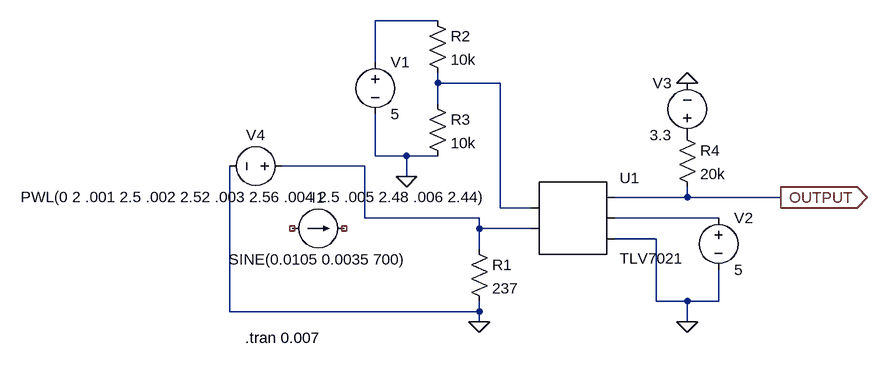
[diagram p0: schematic WheelSpeed_rev11_v2.asc]
WheelSpeed_rev11_v2.asc, the LTspice schematic file:
Version 4
SHEET 1 1016 680
WIRE 304 -16 208 -16
WIRE 208 48 208 -16
WIRE 304 80 304 64
WIRE 400 80 304 80
WIRE 304 112 304 80
WIRE 208 192 208 128
WIRE 256 192 208 192
WIRE 304 192 256 192
WIRE 192 208 64 208
WIRE 256 224 256 192
WIRE 688 256 688 240
WIRE 688 256 576 256
WIRE 832 256 688 256
WIRE 400 272 400 80
WIRE 448 272 400 272
WIRE 192 288 192 208
WIRE 368 288 192 288
WIRE 736 288 576 288
WIRE 368 304 368 288
WIRE 448 304 368 304
WIRE 640 320 576 320
WIRE 368 336 368 304
WIRE 640 416 640 320
WIRE 688 416 640 416
WIRE 736 416 736 368
WIRE 736 416 688 416
WIRE -16 432 -16 208
WIRE 368 432 368 416
WIRE 368 432 -16 432
WIRE 368 448 368 432
WIRE 688 448 688 416
FLAG 688 80 0
FLAG 688 448 0
FLAG 256 224 0
FLAG 368 448 0
FLAG 832 256 OUTPUT
IOPIN 832 256 Out
SYMBOL AutoGenerated/TLV7021 512 288 R0
SYMATTR InstName U1
SYMBOL voltage 208 32 R0
SYMATTR InstName V1
SYMATTR Value 5
SYMBOL voltage 736 272 R0
SYMATTR InstName V2
SYMATTR Value 5
SYMBOL voltage 688 176 R180
WINDOW 0 24 96 Left 2
WINDOW 3 24 16 Left 2
SYMATTR InstName V3
SYMATTR Value 3.3
SYMBOL res 352 320 R0
SYMATTR InstName R1
SYMATTR Value 237
SYMBOL res 288 -32 R0
SYMATTR InstName R2
SYMATTR Value 10k
SYMBOL res 288 96 R0
SYMATTR InstName R3
SYMATTR Value 10k
SYMBOL res 672 144 R0
SYMATTR InstName R4
SYMATTR Value 20k
SYMBOL current 80 304 R270
WINDOW 0 32 40 VTop 2
WINDOW 3 -32 40 VBottom 2
WINDOW 123 0 0 Left 0
WINDOW 39 0 0 Left 0
SYMATTR InstName I1
SYMATTR Value SINE(0.0105 0.0035 700)
SYMBOL voltage 80 208 R90
WINDOW 0 -32 56 VBottom 2
WINDOW 3 32 56 VTop 2
WINDOW 123 0 0 Left 0
WINDOW 39 0 0 Left 0
SYMATTR InstName V4
SYMATTR Value PWL(0 2 .001 2.5 .002 2.52 .003 2.56 .004 2.5 .005 2.48 .006 2.44)
TEXT 8 472 Left 2 !.tran 0.007

The netlist it stands for:
* WheelSpeed_rev11_v2.asc
* U1: TLV7021 (symbol AutoGenerated/TLV7021 not available, pins judged from their places): pin1=N002 pin2=N003 pin3=OUTPUT pin4=N004 pin5=0
V1 N001 0 5
V2 N004 0 5
V3 P001 0 3.3
R1 N003 0 237
R2 N001 N002 10k
R3 N002 0 10k
R4 P001 OUTPUT 20k
I1 NC_01 NC_02 SINE(0.0105 0.0035 700)
V4 N003 0 PWL(0 2 .001 2.5 .002 2.52 .003 2.56 .004 2.5 .005 2.48 .006 2.44)
.tran 0.007
.backanno
.end